# EAGLE design V-00757-00 (EAGLE 7.2.0)

## Sheet 1 of 2
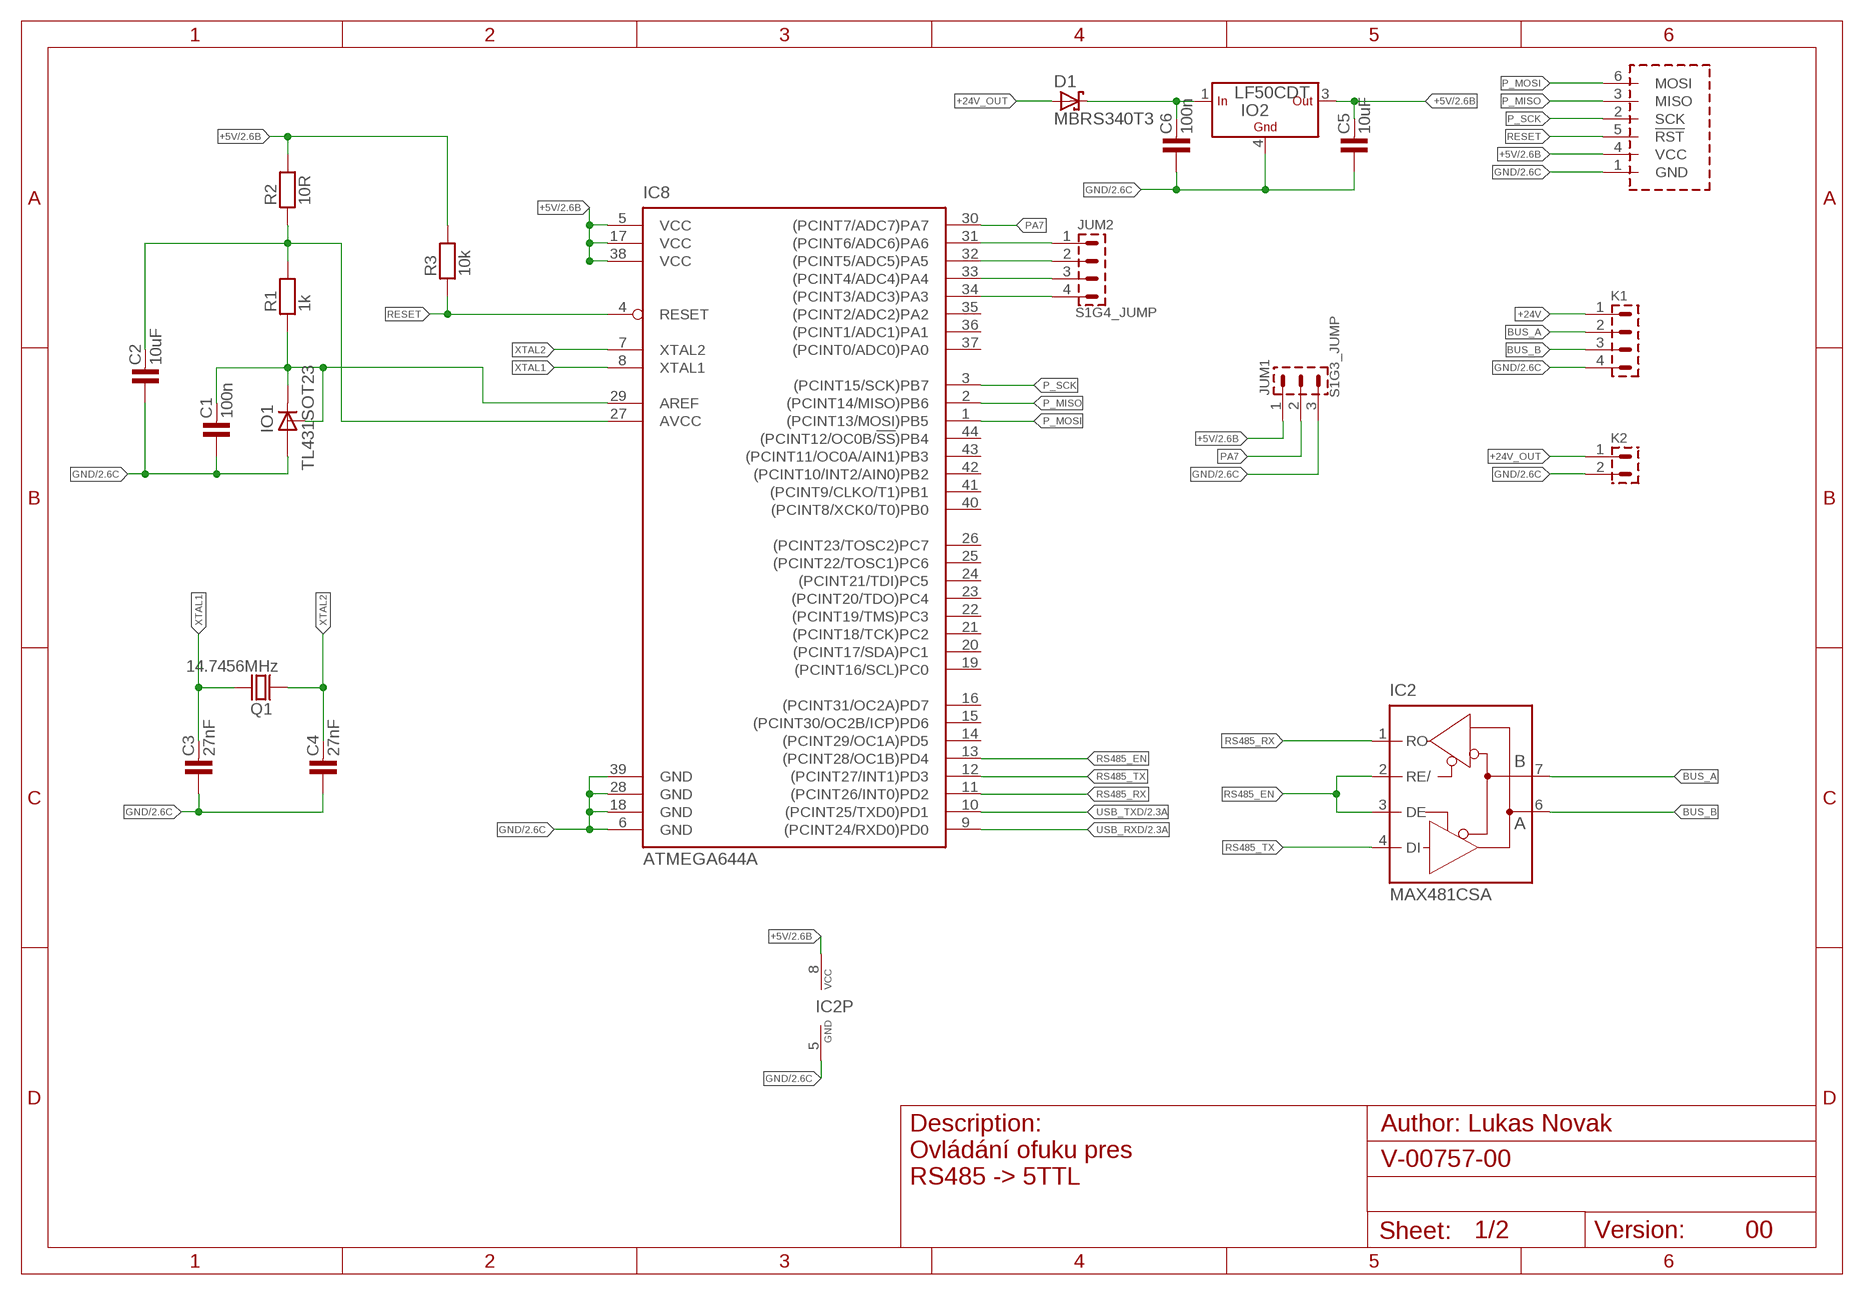
[diagram p0: schematic, sheet 1]

### Parts
C1  100n  C-KER_1206  [1206]
C2  10uF  C-KER_1206  [1206]
C3  27nF  C-KER_0805  [0805]
C4  27nF  C-KER_0805  [0805]
C5  10uF  C-KER_1206  [1206]
C6  100n  C-KER_1206  [1206]
D1  MBRS340T3  [SMC]
IC2  MAX481CSA  [SO08]
IC8  ATMEGA644A  [TQFP44]
IO1  TL431SOT23  [SOT23]
IO2  LF50CDT  LF_CDT  [DPAK]
JUM1  S1G3_JUMP  [S1G3_JUM]
JUM2  S1G4_JUMP  [S1G4_JUM]
K1  PSH02-04P  [PSH02-04P]
K2  PSH02-02P  [PSH02-02P]
Q1  14.7456MHz  Q_HC-49U  [HC-49U]
R1  1k  R_1206  [1206]
R2  10R  R_1206  [1206]
R3  10k  R_1206  [1206]
U$1  AVR_PROG_SPI  [PSH02-06P]

### Nets
+5V: C5.2 IC2.8(VCC) IC8.5(VCC) IC8.17(VCC) IC8.38(VCC) IO2.3(OUT) JUM1.1 R2.2 R3.2 U$1.4(VCC) ; also sheet 2
+24V: C6.2 D1.C IO2.1(IN) K1.1
+24V_OUT: D1.A K2.1
AREF: C1.2 IC8.29(AREF) IO1.1(C) IO1.2(R) R1.1
AVCC: C2.2 IC8.27(AVCC) R1.2 R2.1
BUS_A: IC2.7(B) K1.2
BUS_B: IC2.6(A) K1.3
GND: C1.1 C2.1 C3.1 C4.1 C5.1 C6.1 IC2.5(GND) IC8.6(GND) IC8.18(GND) IC8.28(GND) IC8.39(GND) IO1.3(A) IO2.4(GND) JUM1.3 K1.4 K2.2 U$1.1(GND) ; also sheet 2
N$1: IC8.31((PCINT6/ADC6)PA6) JUM2.1
N$2: IC8.32((PCINT5/ADC5)PA5) JUM2.2
N$5: IC8.33((PCINT4/ADC4)PA4) JUM2.3
N$6: IC8.34((PCINT3/ADC3)PA3) JUM2.4
P_MISO: IC8.2((PCINT14/MISO)PB6) U$1.3(MISO)
P_MOSI: IC8.1((PCINT13/MOSI)PB5) U$1.6(MOSI)
P_SCK: IC8.3((PCINT15/SCK)PB7) U$1.2(SCK)
PA7: IC8.30((PCINT7/ADC7)PA7) JUM1.2
RESET: IC8.4(RESET) R3.1 U$1.5(!RST)
RS485_EN: IC2.2(RE/) IC2.3(DE) IC8.13((PCINT28/OC1B)PD4)
RS485_RX: IC2.1(RO) IC8.11((PCINT26/INT0)PD2)
RS485_TX: IC2.4(DI) IC8.12((PCINT27/INT1)PD3)
USB_RXD: IC8.9((PCINT24/RXD0)PD0) ; also sheet 2
USB_TXD: IC8.10((PCINT25/TXD0)PD1) ; also sheet 2
XTAL1: C3.2 IC8.8(XTAL1) Q1.2
XTAL2: C4.2 IC8.7(XTAL2) Q1.1
Unconnected: IC8.14((PCINT29/OC1A)PD5) IC8.15((PCINT30/OC2B/ICP)PD6) IC8.16((PCINT31/OC2A)PD7) IC8.19((PCINT16/SCL)PC0) IC8.20((PCINT17/SDA)PC1) IC8.21((PCINT18/TCK)PC2) IC8.22((PCINT19/TMS)PC3) IC8.23((PCINT20/TDO)PC4) IC8.24((PCINT21/TDI)PC5) IC8.25((PCINT22/TOSC1)PC6) IC8.26((PCINT23/TOSC2)PC7) IC8.35((PCINT2/ADC2)PA2) IC8.36((PCINT1/ADC1)PA1) IC8.37((PCINT0/ADC0)PA0) IC8.40((PCINT8/XCK0/T0)PB0) IC8.41((PCINT9/CLKO/T1)PB1) IC8.42((PCINT10/INT2/AIN0)PB2) IC8.43((PCINT11/OC0A/AIN1)PB3) IC8.44((PCINT12/OC0B/!SS!)PB4)

### Notes on the sheet
- Ovládání ofuku pres
  RS485 -> 5TTL
- 00

## Sheet 2 of 2
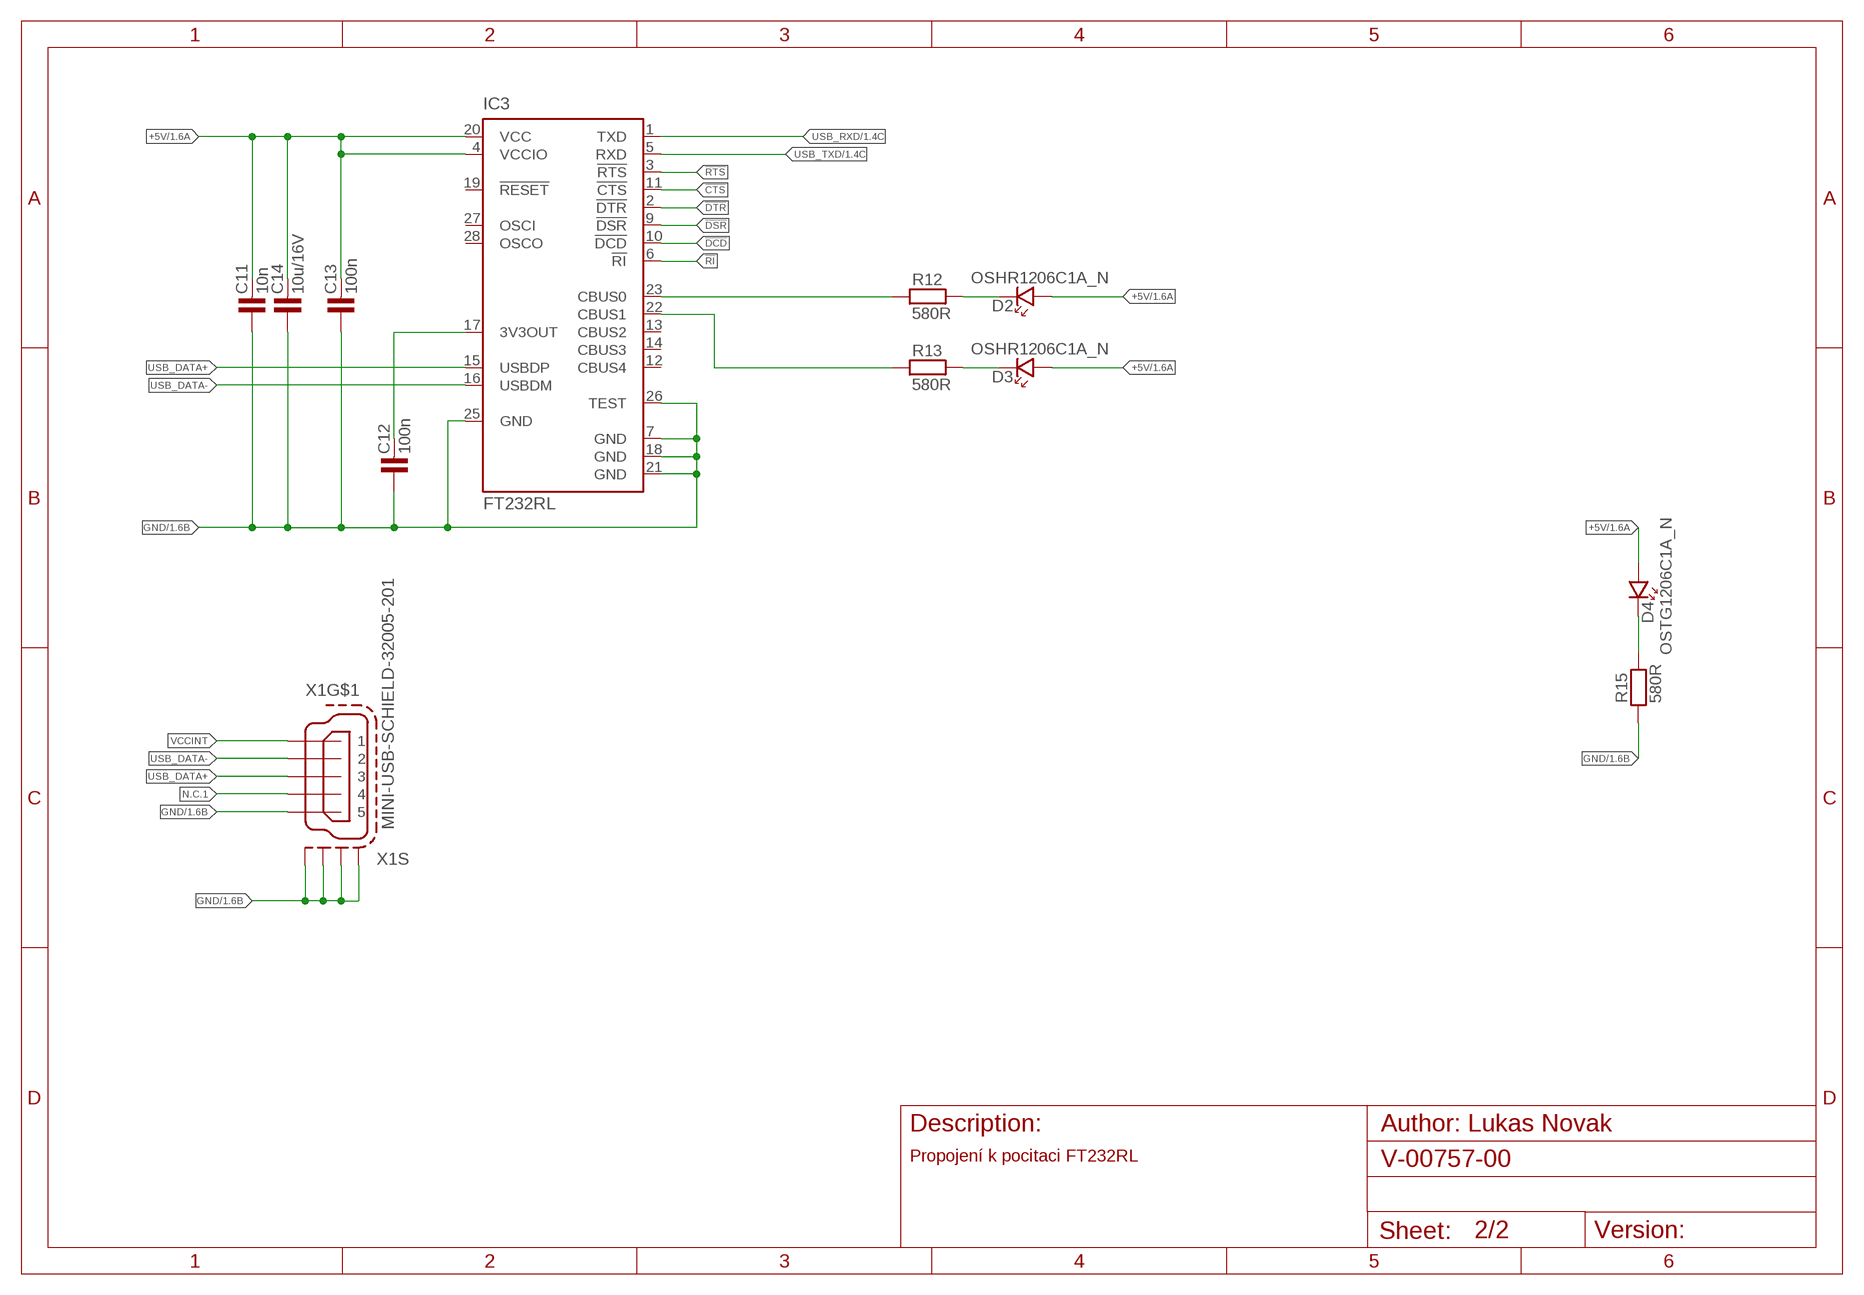
[diagram p1: schematic, sheet 2]

### Parts
C11  10n  C-KER_1206  [1206]
C12  100n  C-KER_1206  [1206]
C13  100n  C-KER_1206  [1206]
C14  10u/16V  C-KER_1206  [1206]
D2  OSHR1206C1A_N  LED_1206  [P1206]
D3  OSHR1206C1A_N  LED_1206  [P1206]
D4  OSTG1206C1A_N  LED_1206  [P1206]
IC3  FT232RL  [SSOP28]
R12  580R  R_1206  [1206]
R13  580R  R_1206  [1206]
R15  580R  R_1206  [1206]
X1  MINI-USB-SCHIELD-32005-201  [32005-201]

### Nets
!CTS: IC3.11(!CTS)
!DCD: IC3.10(!DCD)
!DSR: IC3.9(!DSR)
!DTR: IC3.2(!DTR)
!RI: IC3.6(!RI)
!RTS: IC3.3(!RTS)
+5V: C11.2 C13.2 C14.2 D2.A D3.A D4.A IC3.4(VCCIO) IC3.20(VCC) ; also sheet 1
GND: C11.1 C12.1 C13.1 C14.1 IC3.7(GND) IC3.18(GND) IC3.21(GND) IC3.25(GND) IC3.26(TEST) R15.1 X1.5 X1.M1(S:S1) X1.M2(S:S2) X1.M3(S:S3) X1.M4(S:S4) ; also sheet 1
N$28: IC3.23(CBUS0) R12.1
N$29: IC3.22(CBUS1) R13.1
N$30: C12.2 IC3.17(3V3OUT)
N$31: D2.K R12.2
N$32: D3.K R13.2
N$33: D4.K R15.2
N.C.1: X1.4
USB_DATA+: IC3.15(USBDP) X1.3
USB_DATA-: IC3.16(USBDM) X1.2
USB_RXD: IC3.1(TXD) ; also sheet 1
USB_TXD: IC3.5(RXD) ; also sheet 1
VCCINT: X1.1
Unconnected: IC3.12(CBUS4) IC3.13(CBUS2) IC3.14(CBUS3) IC3.19(!RESET) IC3.27(OSCI) IC3.28(OSCO)

### Notes on the sheet
- Propojení k pocitaci FT232RL

## Library data of the parts
C1-C6 C11-C14 = #PaJa_31:C-KER: Kondenzator - keramicky
D1 = diode:MBRS3*0T3: SCHOTTKY BARRIER RECTIFIER 3.0 AMPERES 20, 30, 40 VOLT Source: MBRS340T3-D.pdf
D2-D4 = #PaJa_31:LED: LED - jednobarevna
IC2 = maxim:MAX481CSA: RS485 TRANSEIVER; MF: MAXIM; MPN: MAX481CSA; OC_FARNELL: unknown; OC_NEWARK: 90C3817
IC3 = ftdichip:FT232R: Source: http://www.ftdichip.com/Documents/DataSheets/DS_FT232R_v104.pdf; MPN: FT232RL; OC_FARNELL: 1146032; OC_NEWARK: 91K9918
IC8 = atmel:ATMEGA644: 8-bit Microcontroller with 64K Bytes In-System Programmable Flash Source: http://www.atmel.com/dyn/resources/prod_documents/doc2593.pdf; MPN: ATMEGA644PV-10AU; OC_FARNELL: 1455123; OC_NEWARK: 58M3748
IO1 = references:TL431: Programmable Shunt Regulator TL431 Features > Programmable Output Voltage to 36 Volts > Low Dynamic Output Impedance 0.2? Typical > Sink Current Capability of 1.0 to 100mA > Equivalent Full-Range Temperature Coefficient of 50ppm/°C Typical > Temperature Compensated For Operation Over Full Rated Operating Temperature Range > Low Output Noise Voltage > Fast Turn-on Response; MPN: TL431BFDT; OC_FARNELL: 2095471; PACKAGE: SOT23; SUPPLIER: NXP
IO2 = #PaJa_31:LF_C: LF??C - stabilizatory low-drop Out= 1,5 / 1,8 / 2,5 / 3,3 / 4,7 / 5 / 6 / 8 / 5,5 / 9 / 12 V Avaiable in +- 1% (AB) , +- 2% (C)
JUM1 = #PaJa_konektory:S1G3_JUMP: Radove konektory - koliky - 3x
JUM2 = #PaJa_konektory:S1G4_JUMP: Radove konektory - koliky - 4x
K1 = #PaJa_konektory:PSH02-04: Konektory se zamkem - vidlice - 4pin
K2 = #PaJa_konektory:PSH02-02: Konektory se zamkem - vidlice - 2pin
Q1 = #PaJa_31:Q: Krystal HC-49 - 1MHz - 48MHz DT38 - Quartz (hodinovy) 32,768kHz
R1-R3 R12 R13 R15 = #PaJa_31:R: Rezistor
U$1 = #PaJa_konektory:AVR_PROG_SPI
X1 = con-cypressindustries:MINI-USB-SCHIELD-: MINI USB-B Conector Source: www.cypressindustries.com; OC_FARNELL: unknown; OC_NEWARK: unknown

## Net classes
0 default: width 0.305 mm, drill 0.3 mm, clearance 0.2 mm
2 Supply: width 0.305 mm, drill 0.3 mm, clearance 0.4 mm to class 0
3 Ground: width 0.305 mm, drill 0.3 mm, clearance 0.2 mm to class 0

## Board
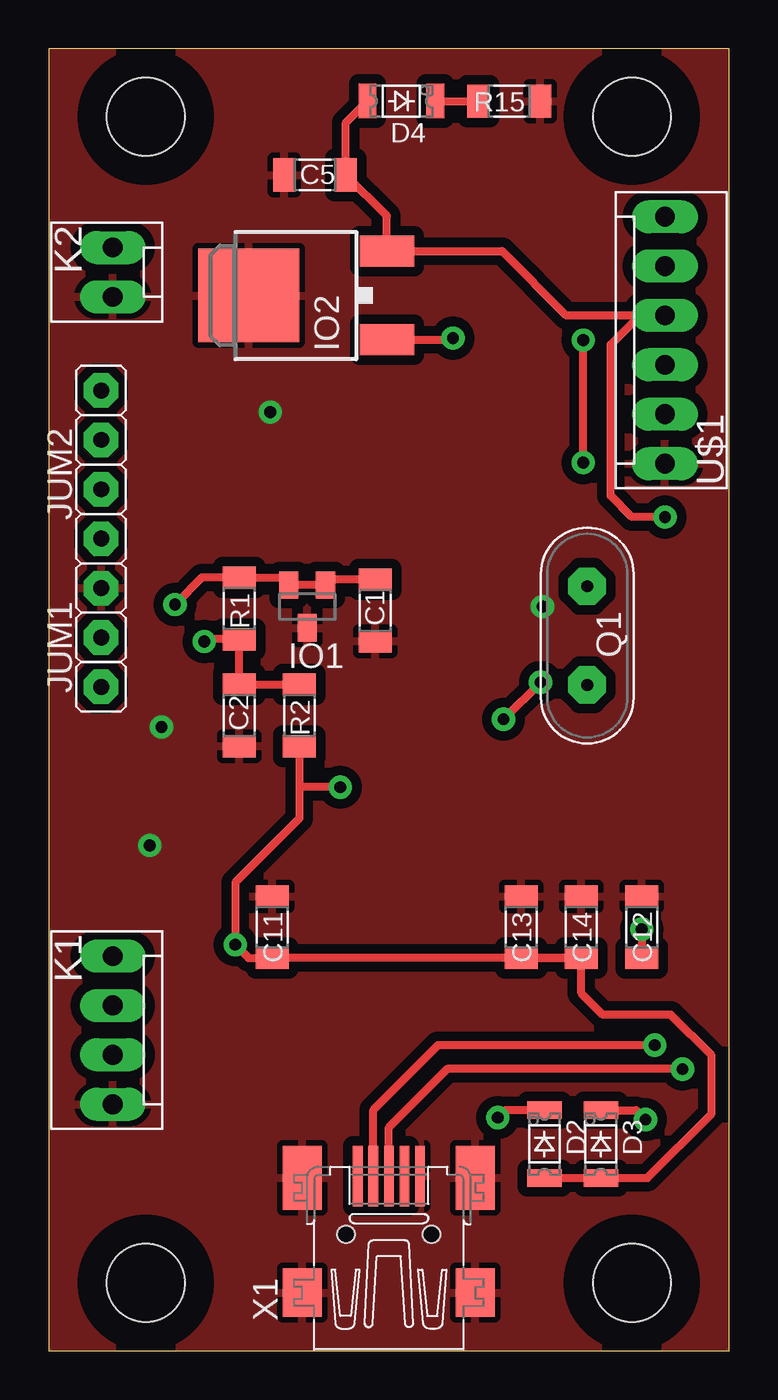
[diagram p2: board, top side]
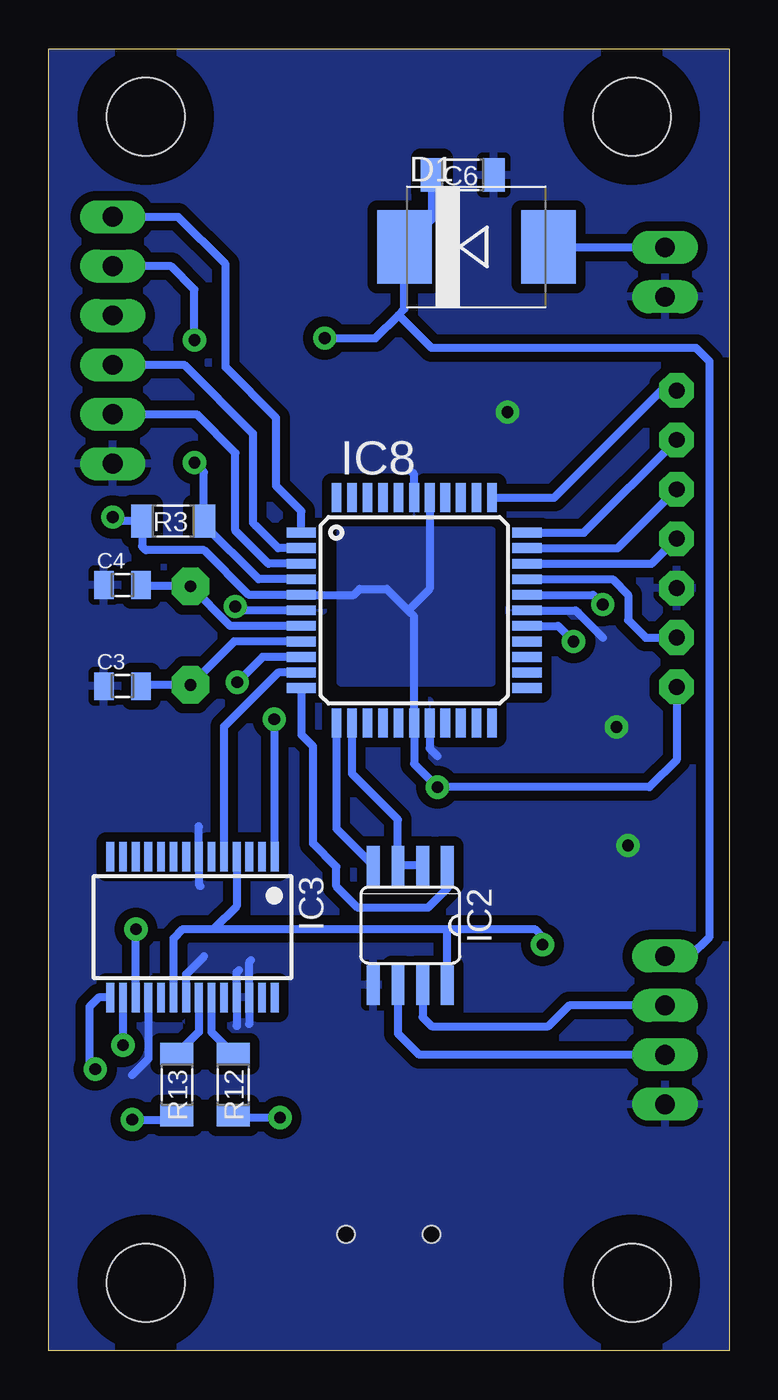
[diagram p3: board, bottom side, seen from below]

Size 35 x 67 mm. Coordinates in mm from the lower left corner, seen from the top.
Outline: 0,0 35,0 35,67 0,67 0,0
Copper layers (1*16): Top 0.04mm / dielectric 1.5mm / Bottom 0.04mm
Design rules "mucha_navrh *": minimum track width 0.2mm, minimum drill 0.6mm, track to track 0.5mm, track to pad 0.5mm, pad to pad 0.3mm, via to via 0.3mm, smd to smd 0mil, copper to edge 0.01mm, drill to drill 0.5mm, minimum pad ring 0.3mm, minimum via ring 0.3mm, stop-mask expansion 0.1mm, vias tented up to drill 0.8mm, thermal gap 0.3mm
Holes 4 mm at 5,3.5 30,3.5 5,63.5 30,63.5
tRestrict: area 26.5,0 to 33.5,7; area 1.5,0 to 8.5,7; area 1.5,60 to 8.5,67; area 26.5,60 to 33.5,67
bRestrict: area 1.5,0 to 8.5,7; area 26.5,0 to 33.5,7; area 1.5,60 to 8.5,67; area 26.5,60 to 33.5,67

### Footprints (pad centres in the part's own frame; a part is rotated, then mirrored left to right if it is on the bottom)
1206 = smd 1.143 x 1.702: 1 -1.587,0; 2 1.587,0
0805 = smd 1.016 x 1.422: 1 -0.953,0; 2 0.953,0
SMC = smd 2.8 x 3.8: A 3.7,0; C -3.7,0
P1206 = smd 0.914 x 1.778: A -1.905,0; K 1.587,0
SO08 = smd 0.66 x 2.032: 1 -1.905,-3.073; 2 -0.635,-3.073; 3 0.635,-3.073; 4 1.905,-3.073; 5 1.905,3.073; 6 0.635,3.073; 7 -0.635,3.073; 8 -1.905,3.073
SSOP28 = smd 0.4 x 1.5: 1 -4.225,-3.625; 2 -3.575,-3.625; 3 -2.925,-3.625; 4 -2.275,-3.625; 5 -1.625,-3.625; 6 -0.975,-3.625; 7 -0.325,-3.625; 8 0.325,-3.625; 9 0.975,-3.625; 10 1.625,-3.625; 11 2.275,-3.625; 12 2.925,-3.625; 13 3.575,-3.625; 14 4.225,-3.625; 15 4.225,3.625; 16 3.575,3.625; 17 2.925,3.625; 18 2.275,3.625; 19 1.625,3.625; 20 0.975,3.625; 21 0.325,3.625; 22 -0.325,3.625; 23 -0.975,3.625; 24 -1.625,3.625; 25 -2.275,3.625; 26 -2.925,3.625; 27 -3.575,3.625; 28 -4.225,3.625
TQFP44 = smd 1.5 x 0.5: 1 -5.8,4; 2 -5.8,3.2; 3 -5.8,2.4; 4 -5.8,1.6; 5 -5.8,0.8; 6 -5.8,0; 7 -5.8,-0.8; 8 -5.8,-1.6; 9 -5.8,-2.4; 10 -5.8,-3.2; 11 -5.8,-4; 23 5.8,-4; 24 5.8,-3.2; 25 5.8,-2.4; 26 5.8,-1.6; 27 5.8,-0.8; 28 5.8,0; 29 5.8,0.8; 30 5.8,1.6; 31 5.8,2.4; 32 5.8,3.2; 33 5.8,4 | smd 0.5 x 1.5: 12 -4,-5.8; 13 -3.2,-5.8; 14 -2.4,-5.8; 15 -1.6,-5.8; 16 -0.8,-5.8; 17 0,-5.8; 18 0.8,-5.8; 19 1.6,-5.8; 20 2.4,-5.8; 21 3.2,-5.8; 22 4,-5.8; 34 4,5.8; 35 3.2,5.8; 36 2.4,5.8; 37 1.6,5.8; 38 0.8,5.8; 39 0,5.8; 40 -0.8,5.8; 41 -1.6,5.8; 42 -2.4,5.8; 43 -3.2,5.8; 44 -4,5.8
SOT23 = smd 1 x 1.4: 1 -0.95,-1.1; 2 0.95,-1.1; 3 0,1.1
DPAK = smd 1.6 x 2.8: 1 -2.28,-4.992; 3 2.28,-4.992 | smd 4.826 x 5.191: 4 0,2.096
S1G3_JUM = drill 0.813 pad 1.778 octagon: 1 -2.54,0; 2 0,0; 3 2.54,0
S1G4_JUM = drill 0.813 pad 1.778 octagon: 1 -3.81,0; 2 -1.27,0; 3 1.27,0; 4 3.81,0
PSH02-04P = drill 1.016 pad 1.422 long: 1 -3.81,0; 2 -1.27,0; 3 1.27,0; 4 3.81,0
PSH02-02P = drill 1.016 pad 1.422 long: 1 -1.27,0; 2 1.27,0
HC-49U = drill 0.61 pad 1.93 octagon: 1 -2.54,0; 2 2.54,0
PSH02-06P = drill 1.016 pad 1.422 long: 1 -6.35,0; 2 -3.81,0; 3 -1.27,0; 4 1.27,0; 5 3.81,0; 6 6.35,0
32005-201 = smd 3.1 x 0.5: 1 3,1.6; 2 3,0.8; 3 3,0; 4 3,-0.8; 5 3,-1.6 | smd 2.5 x 2: M1 -3,-4.45; M2 -3,4.45 | smd 3.3 x 2: M3 2.9,4.45; M4 2.9,-4.45 | hole 0.9: 0,2.2; 0,-2.2

### Placement (x,y rotation side)
C1  16.8,38.1 90 top
C2  9.8,32.7 90 top
C3  31.2,34.2 0 bottom
C4  31.2,39.4 0 bottom
C5  13.7,60.5 0 top
C6  13.7,60.5 180 bottom
C11  11.5,21.8 270 top
C12  30.5,21.8 270 top
C13  24.3,21.8 270 top
C14  27.4,21.8 270 top
D1  13,56.8 0 bottom
D2  25.5,10.8 90 top
D3  28.4,10.8 90 top
D4  18.3,64.3 0 top
IC2  16.4,21.9 180 bottom
IC3  27.6,21.8 180 bottom
IC8  16.2,38.1 0 bottom
IO1  13.3,38.3 180 top
IO2  12.4,54.3 90 top
JUM1  2.7,36.7 90 top
JUM2  2.7,45.6 90 top
K1  3.3,16.5 270 top
K2  3.3,55.5 270 top
Q1  27.7,36.8 270 top
R1  9.8,38.2 270 top
R2  12.9,32.7 270 top
R3  28.6,42.7 180 bottom
R12  25.5,13.7 270 bottom
R13  28.4,13.7 270 bottom
R15  23.7,64.3 180 top
U$1  31.7,52 90 top
X1  17.5,6 90 top

### Tracks (layer width: path | path; a pad name or v marks a point on that pad's centre or on a via)
+5V  (via drill 0.6)
  Top 0.406: U$1.4 30.4,53.27 | 30.4,53.27 26.63,53.27 23.32,56.58 IO2.3 17.39,58.4 C5.2 15.29,63.19 D4.A | v31.7,42.9 30,42.9 28.9,44 28.9,51.77 30.4,53.27 | C13.2 C14.2 | C11.2 11.1,20.21 | C14.2 C11.2 | R2.2 12.9,28.9 | 12.9,28.9 12.9,27.4 9.6,24.1 v9.6,20.9 10.29,20.21 C11.2 | v15,29 13,29 12.9,28.9 | D2.A D3.A 30.8,8.89 34.1,12.2 34.1,15.2 32,17.3 28.5,17.3 27.4,18.4 C14.2
  Bottom 0.406: v31.7,42.9 31.5,42.7 R3.2 30.19,41.39 30,41.2 27,41.2 24.7,38.9 IC8.5 19.3,38.9 19,39.2 17.6,39.2 16.5,38.1 | IC3.20 28.57,21.23 28.1,21.7 26.5,21.7 | 26.5,21.7 14.4,21.7 | 14.4,21.7 10,21.7 9.6,21.3 v9.6,20.9 | IC2.8 14.49,21.61 14.4,21.7 | 16.5,38.1 16.2,37.8 IC8.17 16.2,30.2 v15,29 4.1,29 2.7,30.4 JUM1.1 | IC8.38 15.4,39.2 16.5,38.1 | IC3.4 25.32,22.88 26.5,21.7
  pour Bottom (rank 5): 12.2,42.2 20,42.2 20,34.4 12.2,34.4
+24V  (via drill 0.6)
  Top 0.406: IO2.1 20.72,52.02 v20.8,52.1
  Bottom 0.406: C6.2 15.29,58.21 D1.C 16.7,53.6 17,53.3 | v20.8,52.1 18.2,52.1 17,53.3 | K1.1 1.99,20.31 1,21.3 1,50.9 1.7,51.6 15.3,51.6 17,53.3
+24V_OUT
  Bottom 0.406: K2.1 9.27,56.77 D1.A
AREF  (via drill 0.6)
  Top 0.406: v6.5,38.4 7.89,39.79 R1.1 11.96,39.79 IO1.2 IO1.1 14.54,39.69 C1.2
  Bottom 0.406: IC8.29 7,38.9 v6.5,38.4
AVCC  (via drill 0.6)
  Top 0.406: v8,36.5 8.11,36.61 R1.2 C2.2 R2.1
  Bottom 0.406: IC8.27 8.8,37.3 v8,36.5
BUS_A
  Bottom 0.406: IC2.7 15.77,17.16 15.3,16.7 9.3,16.7 8.23,17.77 K1.2
BUS_B
  Bottom 0.406: IC2.6 17.04,16.34 15.93,15.23 K1.3
GND  (via drill 0.6)
  Top 0.406: 10.23,54.23 IO2.4
  Bottom 0.406: IC8.28 7.9,38.1 6.5,36.7 | IC8.39 16.2,45.1 16.3,45.2 | IC8.18 15.4,31 15,30.6 | IC3.21 27.93,19.38 27,20.3 | 25.2,19.6 25.32,19.48 IC3.25 25.32,16.73 25.3,16.7 | 24.6,20.1 24.68,20.02 IC3.26 24.68,16.82 24.7,16.8 | 27.2,23.9 27.27,23.98 IC3.7 27.27,26.98 27.3,27 | IC8.6 25.2,38.1 v25.4,38.3 | IC3.18 29.88,15.03 30.7,14.2
  other vias: 5.8,32.1 5.2,26 11.4,48.3
  pour Bottom (rank 6): 0,0 35,0 35,67 0,67
  pour Top (rank 6): 0,0 35,0 35,67 0,67
N$1
  Bottom 0.406: IC8.31 3.99,40.5 JUM2.1
N$2
  Bottom 0.406: IC8.32 5.73,41.3 JUM2.2
N$5
  Bottom 0.406: IC8.33 7.47,42.1 JUM2.3
N$6
  Bottom 0.406: JUM2.4 3.49,49.41 9,43.9 IC8.34
N$28
  Bottom 0.406: IC3.23 26.62,16.41 R12.1
N$29
  Bottom 0.406: IC3.22 27.27,16.41 R13.1
N$30  (via drill 0.6)
  Top 0.406: v30.5,21.7 C12.2
  Bottom 0.406: IC3.17 30.52,21.68 v30.5,21.7
N$31  (via drill 0.6)
  Top 0.406: D2.K 23.49,12.39 v23.1,12
  Bottom 0.406: v23.1,12 25.39,12 R12.2
N$32  (via drill 0.6)
  Top 0.406: D3.K 30.21,12.39 v30.7,11.9
  Bottom 0.406: v30.7,11.9 28.61,11.9 R13.2
N$33
  Top 0.406: D4.K R15.2
P_MISO
  Bottom 0.406: IC8.2 23.2,41.3 24.35,42.45 24.5,42.6 24.5,47.2 28.03,50.73 U$1.3
P_MOSI
  Bottom 0.406: IC8.1 22,43.2 23.3,44.5 23.3,48 25.9,50.6 25.9,55.9 28.35,58.35 U$1.6
P_SCK
  Bottom 0.406: IC8.3 23.7,40.5 25.4,42.2 25.4,46.2 27.39,48.19 U$1.2
PA7
  Bottom 0.406: IC8.30 6,39.7 5.2,38.9 5.2,37.6 4.3,36.7 JUM1.2
RESET  (via drill 0.6)
  Top 0.406: v27.5,45.7 v27.5,52
  Bottom 0.406: IC8.4 24.2,39.7 27.01,42.51 R3.1 27.01,45.21 v27.5,45.7 | v27.5,52 27.5,54.6 28.7,55.8 U$1.5
RS485_EN
  Bottom 0.406: IC2.2 IC2.3 17.04,27.34 17.1,27.4 17.2,27.5 19.4,29.7 IC8.13
RS485_RX
  Bottom 0.406: IC8.11 22,31.7 21.4,31.1 21.4,26.1 20.2,24.9 20.2,23.9 19.1,22.8 15.5,22.8 14.49,23.8 IC2.1
RS485_TX
  Bottom 0.406: IC8.12 20.2,26.87 IC2.4
USB_DATA+  (via drill 0.6)
  Top 0.406: X1.3 17.5,11.5 20.5,14.5 v32.6,14.5
  Bottom 0.406: IC3.15 32.42,18.18 32.9,17.7 32.9,14.8 v32.6,14.5
USB_DATA-  (via drill 0.6)
  Top 0.406: X1.2 16.7,12.4 20.02,15.72 v31.18,15.72
  Bottom 0.406: IC3.16 v31.18,15.72
USB_RXD  (via drill 0.6)
  Top 0.406: v25.3,34.4 v23.4,32.5
  Bottom 0.406: IC8.9 24,35.7 v25.3,34.4 | IC3.1 23.38,32.48 v23.4,32.5
USB_TXD
  Bottom 0.406: IC8.10 23.2,34.9 25.98,32.12 IC3.5
XTAL1
  Bottom 0.406: IC8.8 25.46,36.5 Q1.2 30.19,34.26 C3.2
XTAL2
  Bottom 0.406: IC8.7 25.66,37.3 Q1.1 30.19,39.34 C4.2